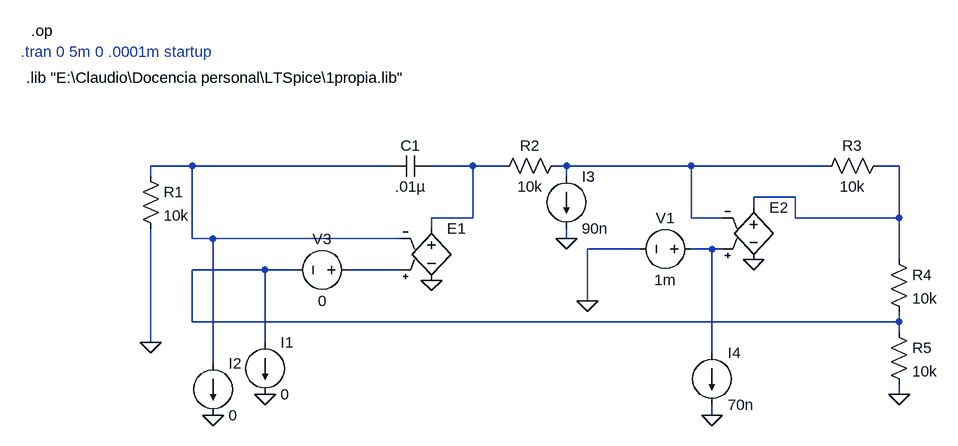
[diagram p0: schematic retardo2.asc]
retardo2.asc, the LTspice schematic file:
Version 4
SHEET 1 1388 680
WIRE 112 80 48 80
WIRE 416 80 112 80
WIRE 544 80 480 80
WIRE 592 80 544 80
WIRE 688 80 672 80
WIRE 880 80 688 80
WIRE 1088 80 880 80
WIRE 1200 80 1168 80
WIRE 48 96 48 80
WIRE 688 96 688 80
WIRE 1040 128 976 128
WIRE 976 144 976 128
WIRE 544 160 544 80
WIRE 544 160 480 160
WIRE 880 160 880 80
WIRE 928 160 880 160
WIRE 1040 160 1040 128
WIRE 1200 160 1200 80
WIRE 1200 160 1040 160
WIRE 480 176 480 160
WIRE 112 192 112 80
WIRE 144 192 112 192
WIRE 432 192 144 192
WIRE 688 192 688 176
WIRE 800 208 720 208
WIRE 912 208 880 208
WIRE 928 208 912 208
WIRE 1200 224 1200 160
WIRE 224 240 112 240
WIRE 272 240 224 240
WIRE 432 240 352 240
WIRE 720 288 720 208
WIRE 112 320 112 240
WIRE 1200 320 1200 304
WIRE 1200 320 112 320
WIRE 1200 336 1200 320
WIRE 48 352 48 176
WIRE 224 352 224 240
WIRE 912 368 912 208
WIRE 144 384 144 192
WIRE 1200 432 1200 416
WIRE 912 464 912 448
FLAG 720 288 0
FLAG 1200 432 0
FLAG 48 352 0
FLAG 480 256 0
FLAG 976 224 0
FLAG 224 432 0
FLAG 144 464 0
FLAG 688 192 0
FLAG 912 464 0
DATAFLAG 1200 144 ""
DATAFLAG 544 80 ""
SYMBOL cap 480 64 R90
WINDOW 0 0 32 VBottom 2
WINDOW 3 32 32 VTop 2
SYMATTR InstName C1
SYMATTR Value .01µ
SYMBOL res 32 80 R0
SYMATTR InstName R1
SYMATTR Value 10k
SYMBOL res 688 64 R90
WINDOW 0 0 56 VBottom 2
WINDOW 3 32 56 VTop 2
SYMATTR InstName R2
SYMATTR Value 10k
SYMBOL res 1184 64 R90
WINDOW 0 0 56 VBottom 2
WINDOW 3 32 56 VTop 2
SYMATTR InstName R3
SYMATTR Value 10k
SYMBOL res 1184 208 R0
SYMATTR InstName R4
SYMATTR Value 10k
SYMBOL res 1184 320 R0
SYMATTR InstName R5
SYMATTR Value 10k
SYMBOL voltage 368 240 R90
WINDOW 0 -32 56 VBottom 2
WINDOW 3 32 56 VTop 2
WINDOW 123 0 0 Left 0
WINDOW 39 0 0 Left 0
SYMATTR InstName V3
SYMATTR Value 0
SYMBOL e2 480 160 R0
WINDOW 3 24 96 Invisible 2
SYMATTR Value (-100,-12)(-.6u,-12)(.6u,12)(100,12)
SYMATTR InstName E1
SYMATTR SpiceModel table
SYMBOL e2 976 128 R0
WINDOW 3 24 96 Invisible 2
SYMATTR Value (-100,-12)(-.6u,-12)(.6u,12)(100,12)
SYMATTR InstName E2
SYMATTR SpiceModel table
SYMBOL current 224 352 R0
WINDOW 123 0 0 Left 0
WINDOW 39 0 0 Left 0
SYMATTR InstName I1
SYMATTR Value 0
SYMBOL current 144 384 R0
WINDOW 123 0 0 Left 0
WINDOW 39 0 0 Left 0
SYMATTR InstName I2
SYMATTR Value 0
SYMBOL voltage 896 208 R90
WINDOW 0 -32 56 VBottom 2
WINDOW 3 32 56 VTop 2
WINDOW 123 0 0 Left 0
WINDOW 39 0 0 Left 0
SYMATTR InstName V1
SYMATTR Value 1m
SYMBOL current 688 96 R0
WINDOW 123 0 0 Left 0
WINDOW 39 0 0 Left 0
SYMATTR InstName I3
SYMATTR Value 90n
SYMBOL current 912 368 R0
WINDOW 123 0 0 Left 0
WINDOW 39 0 0 Left 0
SYMATTR InstName I4
SYMATTR Value 70n
TEXT -152 -96 Left 2 ;.tran 0 5m 0 .0001m startup
TEXT -144 -56 Left 2 !.lib "E:\\Claudio\\Docencia personal\\LTSpice\\1propia.lib"
TEXT -136 -128 Left 2 !.op

The netlist it stands for:
* retardo2.asc
C1 N002 N001 .01µ
R1 N001 0 10k
R2 N003 N002 10k
R3 N004 N003 10k
R4 N004 N006 10k
R5 N006 0 10k
V3 N007 N006 0
E1 N002 0 N007 N001 table (-100,-12)(-.6u,-12)(.6u,12)(100,12)
E2 N004 0 N005 N003 table (-100,-12)(-.6u,-12)(.6u,12)(100,12)
I1 N006 0 0
I2 N001 0 0
V1 N005 0 1m
I3 N003 0 90n
I4 N005 0 70n
* .tran 0 5m 0 .0001m startup
.lib "E:\Claudio\Docencia personal\LTSpice\1propia.lib"
.op
.backanno
.end